# EAGLE design untitled (EAGLE 9.1.0)
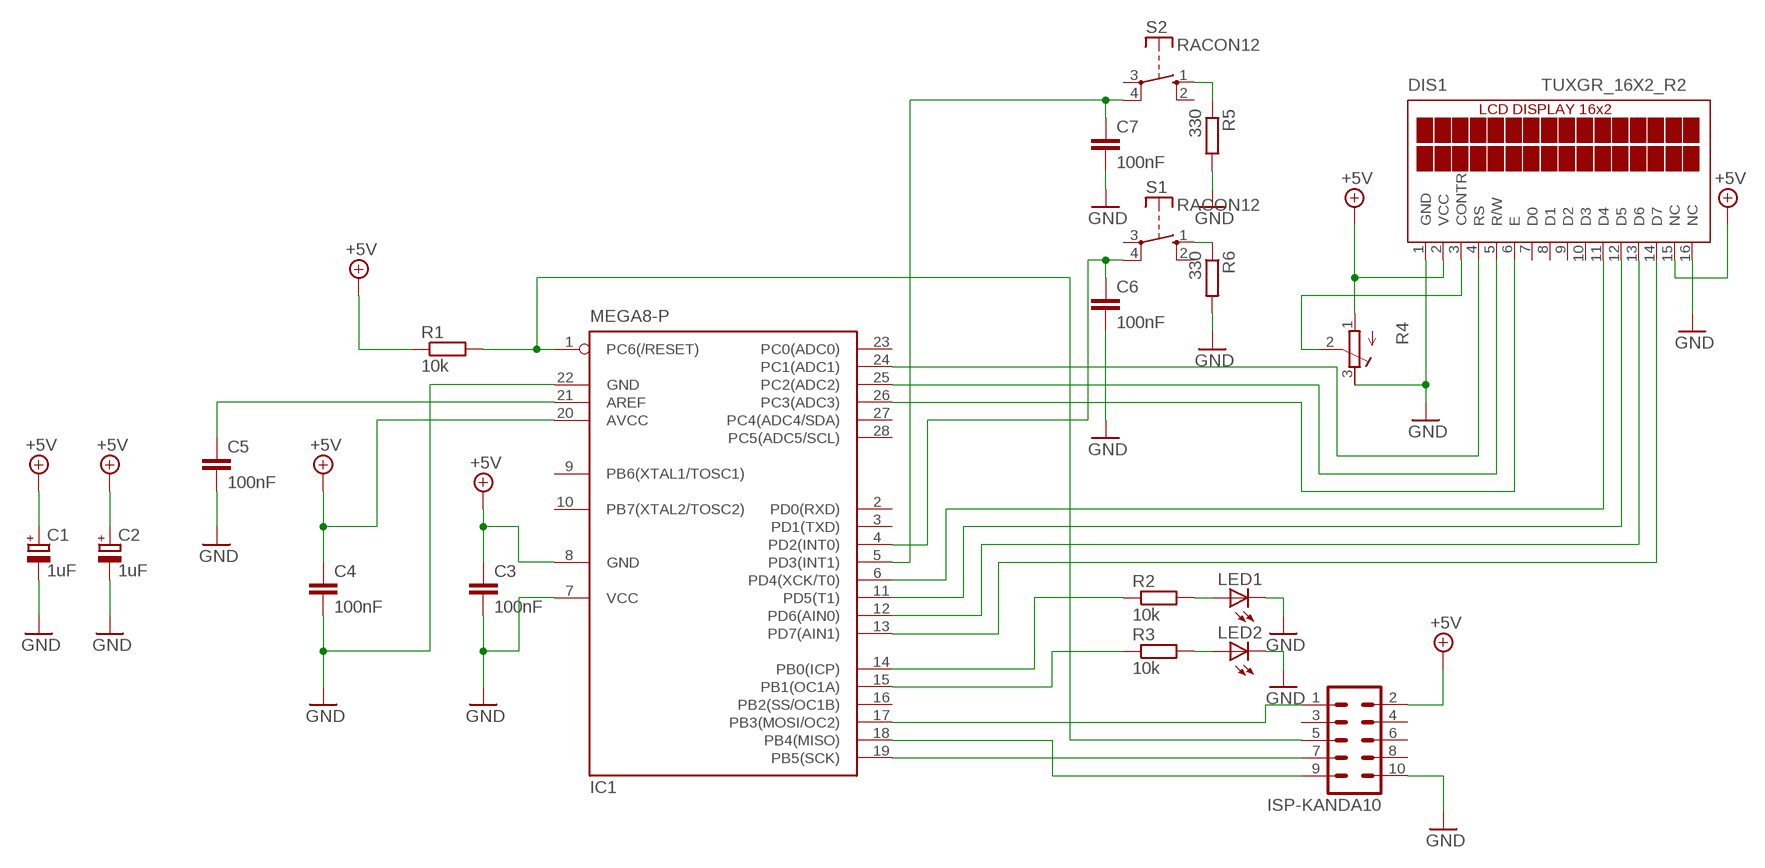
[diagram p0: schematic, sheet 1]

## Parts
C1  1uF  CPOL-EUE2-5  [E2-5]
C2  1uF  CPOL-EUE3.5-8  [E3,5-8]
C3  100nF  C-EU050-024X044  [C050-024X044]
C4  100nF  C-EU050-024X044  [C050-024X044]
C5  100nF  C-EU050-024X044  [C050-024X044]
C6  100nF  C-EU050-024X044  [C050-024X044]
C7  100nF  C-EU050-024X044  [C050-024X044]
DIS1  TUXGR_16X2_R2  [TUXGR_16X2_R2]
IC1  MEGA8-P  [DIL28-3]
ISP-KANDA10  ML10  [ML10]
LED1  LED3MM  [LED3MM]
LED2  LED3MM  [LED3MM]
R1  10k  R-EU_0204/7  [0204/7]
R2  10k  R-EU_0204/7  [0204/7]
R3  10k  R-EU_0204/7  [0204/7]
R4  R-TRIMM3339P  [RTRIM3339P]
R5  330  R-EU_0204/7  [0204/7]
R6  330  R-EU_0204/7  [0204/7]
S1  RACON12  [RACON12]
S2  RACON12  [RACON12]

## Nets
+5V: C1.+ C2.+ C3.1 C4.1 DIS1.2(VCC) DIS1.15(NC) IC1.8(GND) IC1.20(AVCC) ISP-KANDA10.2 R1.1 R4.1(A)
GND: C1.- C2.- C3.2 C4.2 C5.2 C6.2 C7.2 DIS1.1(GND) DIS1.16(NC) IC1.7(VCC) IC1.22(GND) ISP-KANDA10.10 LED1.K(C) LED2.K(C) R4.3(E) R5.2 R6.2
N$1: IC1.1(PC6(/RESET)) ISP-KANDA10.5 R1.2
N$2: IC1.17(PB3(MOSI/OC2)) ISP-KANDA10.1
N$3: IC1.15(PB1(OC1A)) R3.1
N$4: IC1.19(PB5(SCK)) ISP-KANDA10.7
N$5: IC1.18(PB4(MISO)) ISP-KANDA10.9
N$6: C6.1 IC1.4(PD2(INT0)) S1.4(P)
N$7: IC1.14(PB0(ICP)) R2.1
N$8: LED1.A R2.2
N$9: C5.1 IC1.21(AREF)
N$10: LED2.A R3.2
N$11: DIS1.3(CONTR) R4.2(S)
N$12: DIS1.4(RS) IC1.24(PC1(ADC1))
N$13: DIS1.14(D7) IC1.13(PD7(AIN1))
N$14: DIS1.13(D6) IC1.12(PD6(AIN0))
N$15: DIS1.12(D5) IC1.11(PD5(T1))
N$16: DIS1.11(D4) IC1.6(PD4(XCK/T0))
N$17: DIS1.5(R/W) IC1.25(PC2(ADC2))
N$18: DIS1.6(E) IC1.26(PC3(ADC3))
N$19: C7.1 IC1.5(PD3(INT1)) S2.4(P)
N$20: R5.1 S2.1(S)
N$21: R6.1 S1.1(S)
Unconnected: DIS1.7(D0) DIS1.8(D1) DIS1.9(D2) DIS1.10(D3) IC1.2(PD0(RXD)) IC1.3(PD1(TXD)) IC1.9(PB6(XTAL1/TOSC1)) IC1.10(PB7(XTAL2/TOSC2)) IC1.16(PB2(SS/OC1B)) IC1.23(PC0(ADC0)) IC1.27(PC4(ADC4/SDA)) IC1.28(PC5(ADC5/SCL)) ISP-KANDA10.3 ISP-KANDA10.4 ISP-KANDA10.6 ISP-KANDA10.8 S1.2(S) S1.3(P) S2.2(S) S2.3(P)

## Library data of the parts
C1 C2 = rcl:CPOL-EU: POLARIZED CAPACITOR, European symbol; SPICEPREFIX: C
C3-C7 = rcl:C-EU: CAPACITOR, European symbol; SPICEPREFIX: C
DIS1 = display-lcd:TUXGR_16X2_R2: Tuxgraphics LCD display 16x2 characters reflective, without background light Source: tuxgr_12x2_r2.pdf; OC_FARNELL: unknown; OC_NEWARK: unknown
IC1 = atmel:MEGA8-P: MICROCONTROLLER 8 Kbytes FLASH, 1 kbytes SRAM, 512 bytes EEPROM, USART, 4-channel 10 bit ADC, 2-channel 8 bit ADC Pin compatible with Atmega48, ATMega88, ATMega168 Source: avr.lbr; OC_FARNELL: unknown; OC_NEWARK: unknown
ISP-KANDA10 = con-harting-ml:ML10: HARTING; OC_FARNELL: unknown; OC_NEWARK: unknown
LED1 LED2 = led:LED: LED OSRAM: - CHIPLED LG R971, LG N971, LY N971, LG Q971, LY Q971, LO R971, LY R971 LH N974, LH R974 LS Q976, LO Q976, LY Q976 LO Q996 - Hyper CHIPLED LW Q18S LB Q993, LB Q99A, LB R99A - SideLED LS A670, LO A670, LY A670, LG A670, LP A670 LB A673, LV A673, LT A673, LW A673 LH A674 LY A675 LS A676, LA A676, LO A676, LY A676, LW A676 LS A679, LY A679, LG A679 - Hyper Micro SIDELED® LS Y876, LA Y876, LO Y876, LY Y876 LT Y87S - SmartLED LW L88C, LW L88S LB L89C, LB L89S, LG L890 LS L89K, LO L89K, LY L89K LS L896, LA L896, LO L896, LY L896 - TOPLED LS T670, LO T670, LY T670, LG T670, LP T670 LSG T670, LSP T670, LSY T670, LOP T670, LYG T670 LG T671, LOG T671, LSG T671 LB T673, LV T673, LT T673, LW T673 LH T674 LS T676, LA T676, LO T676, LY T676, LB T676, LH T676, LSB T676, LW T676 LB T67C, LV T67C, LT T67C, LS T67K, LO T67K, LY T67K, LW E67C LS E67B, LA E67B, LO E67B, LY E67B, LB E67C, LV E67C, LT E67C LW T67C LS T679, LY T679, LG T679 LS T770, LO T770, LY T770, LG T770, LP T770 LB T773, LV T773, LT T773, LW T773 LH T774 LS E675, LA E675, LY E675, LS T675 LS T776, LA T776, LO T776, LY T776, LB T776 LHGB T686 LT T68C, LB T68C - Hyper Mini TOPLED® LB M676 - Mini TOPLED Santana® LG M470 LS M47K, LO M47K, LY M47K Source: http://www.osram.convergy.de LUXEON: - LUMILED® LXK2-PW12-R00, LXK2-PW12-S00, LXK2-PW14-U00, LXK2-PW14-V00 LXK2-PM12-R00, LXK2-PM12-S00, LXK2-PM14-U00 LXK2-PE12-Q00, LXK2-PE12-R00, LXK2-PE12-S00, LXK2-PE14-T00, LXK2-PE14-U00 LXK2-PB12-K00, LXK2-PB12-L00, LXK2-PB12-M00, LXK2-PB14-N00, LXK2-PB14-P00, LXK2-PB14-Q00 LXK2-PR12-L00, LXK2-PR12-M00, LXK2-PR14-Q00, LXK2-PR14-R00 LXK2-PD12-Q00, LXK2-PD12-R00, LXK2-PD12-S00 LXK2-PH12-R00, LXK2-PH12-S00 LXK2-PL12-P00, LXK2-PL12-Q00, LXK2-PL12-R00 Source: www.luxeon.com KINGBRIGHT: KA-3528ASYC Source: www.kingbright.com
R1-R3 R5 R6 = rcl:R-EU_: RESISTOR, European symbol; SPICEPREFIX: R
R4 = rcl:R-TRIMM: Trimm resistor; SPICEMODEL: X; SPICEPREFIXL: POT
S1 S2 = switch-misc:RACON12: ITT SWITCH

## Board
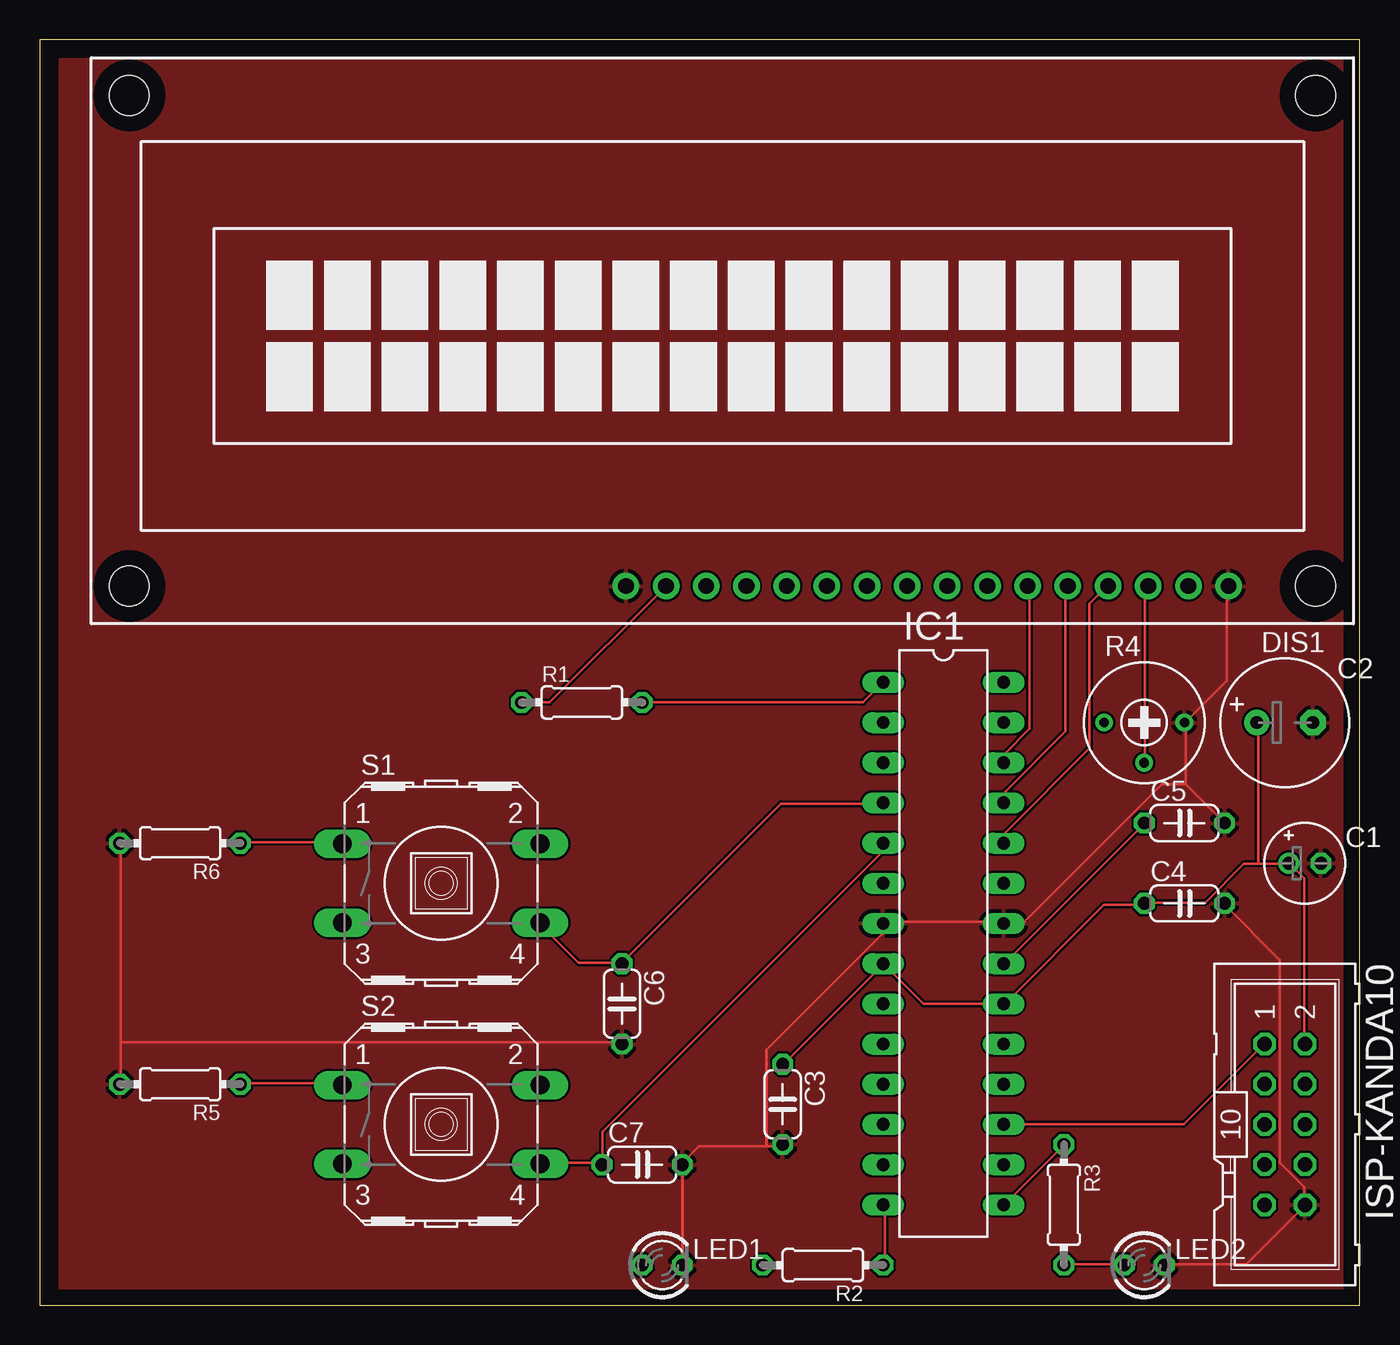
[diagram p1: board, top side]
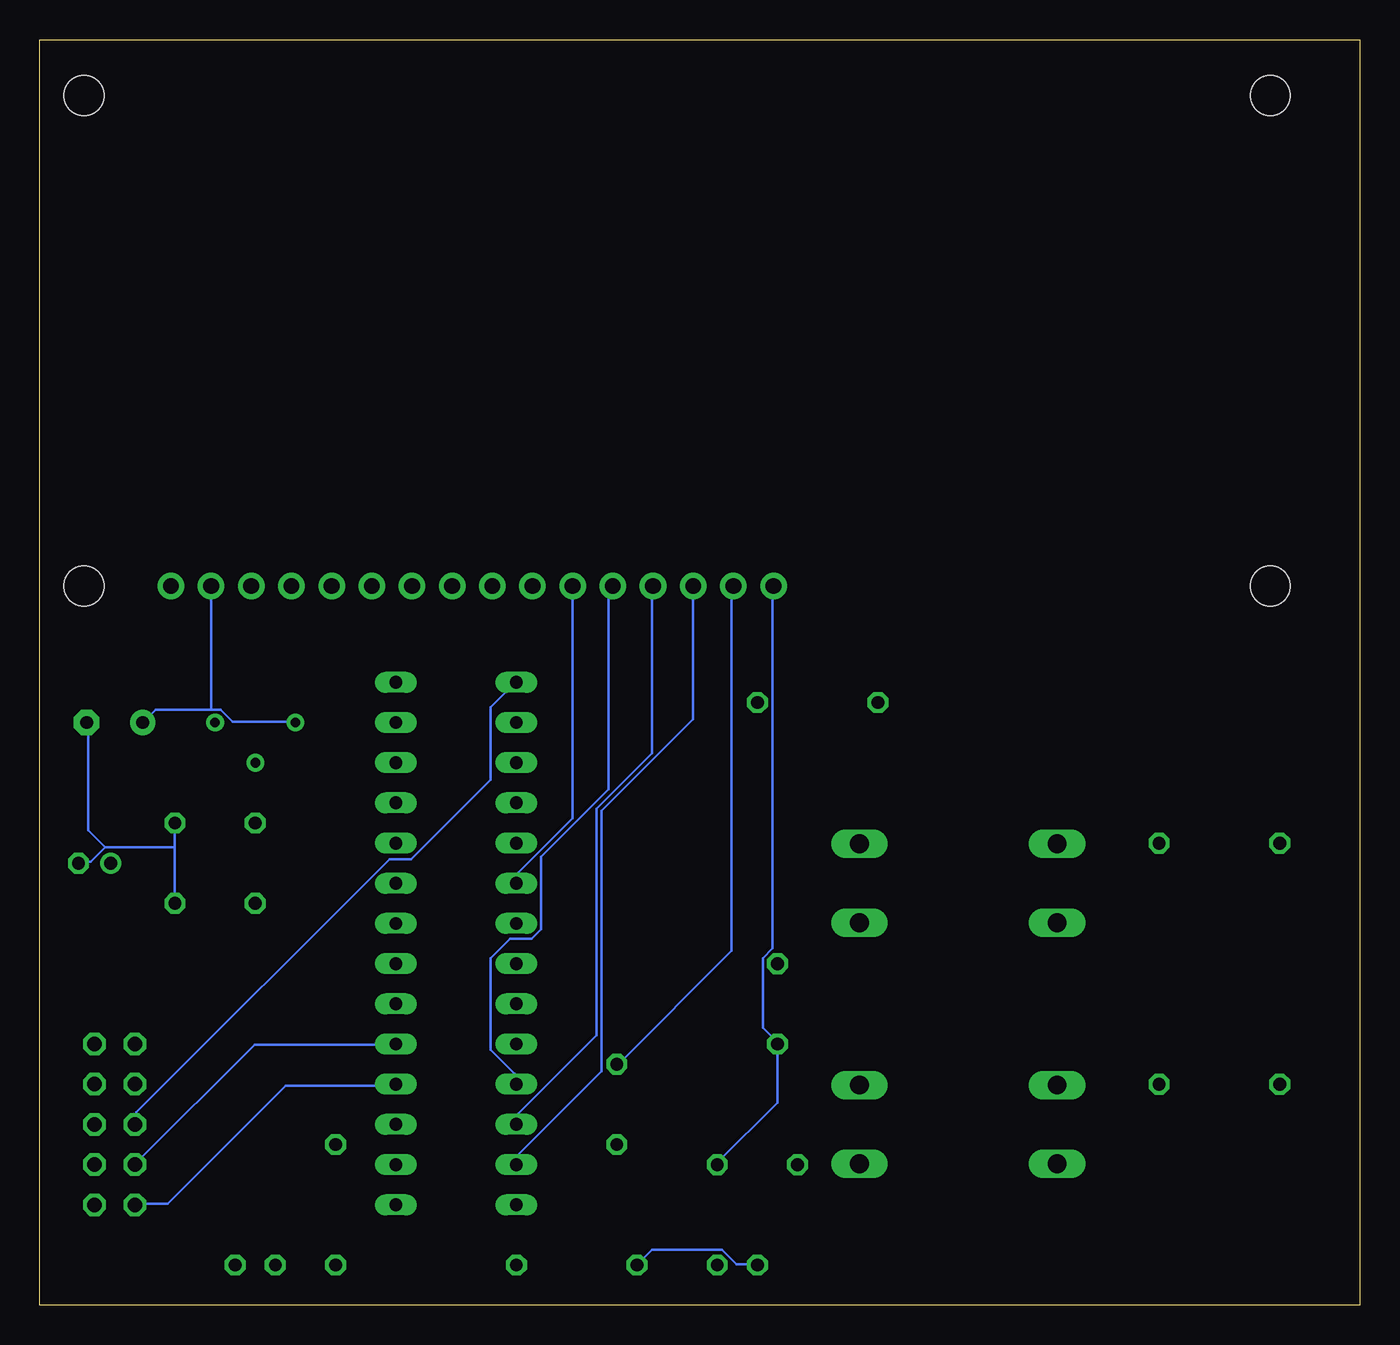
[diagram p2: board, bottom side, seen from below]

Size 83.49 x 80 mm. Coordinates in mm from the lower left corner, seen from the top.
Outline: 0,0 83.49,0 83.49,80 0,80 0,0
Copper layers (1*16): Top 0.035mm / dielectric 1.5mm / Bottom 0.035mm
Design rules "default": minimum track width 6mil, minimum drill 0.35mm, track to track 6mil, track to pad 6mil, pad to pad 6mil, via to via 6mil, smd to smd 6mil, copper to edge 40mil, drill to drill 6mil, minimum pad ring 10mil, minimum via ring 8mil, stop-mask expansion 4mil, vias tented up to drill 0mil, thermal gap 10mil

### Footprints (pad centres in the part's own frame; a part is rotated, then mirrored left to right if it is on the bottom)
E2-5 = drill 0.813 pad 1.27: + -1.016,0 | drill 0.813 pad 1.27 octagon: - 1.016,0
E3,5-8 = drill 0.813 pad 1.6: + -1.778,0 | drill 0.813 pad 1.6 octagon: - 1.778,0
C050-024X044 = drill 0.813 octagon: 1 -2.54,0; 2 2.54,0
TUXGR_16X2_R2 = drill 1 pad 1.676: 1 -32,15.5; 2 -29.46,15.5; 3 -26.92,15.5; 4 -24.38,15.5; 5 -21.84,15.5; 6 -19.3,15.5; 7 -16.76,15.5; 8 -14.22,15.5; 9 -11.68,15.5; 10 -9.14,15.5; 11 -6.6,15.5; 12 -4.06,15.5; 13 -1.52,15.5; 14 1.02,15.5; 15 3.56,15.5; 16 6.1,15.5 | hole 2.5: -37.5,-15.5; 37.5,-15.5; -37.5,15.5; 37.5,15.5
DIL28-3 = drill 0.813 long: 1 -16.51,-3.81; 2 -13.97,-3.81; 3 -11.43,-3.81; 4 -8.89,-3.81; 5 -6.35,-3.81; 6 -3.81,-3.81; 7 -1.27,-3.81; 8 1.27,-3.81; 9 3.81,-3.81; 10 6.35,-3.81; 11 8.89,-3.81; 12 11.43,-3.81; 13 13.97,-3.81; 14 16.51,-3.81; 15 16.51,3.81; 16 13.97,3.81; 17 11.43,3.81; 18 8.89,3.81; 19 6.35,3.81; 20 3.81,3.81; 21 1.27,3.81; 22 -1.27,3.81; 23 -3.81,3.81; 24 -6.35,3.81; 25 -8.89,3.81; 26 -11.43,3.81; 27 -13.97,3.81; 28 -16.51,3.81
ML10 = drill 0.914 octagon: 1 -5.08,-1.27; 2 -5.08,1.27; 3 -2.54,-1.27; 4 -2.54,1.27; 5 0,-1.27; 6 0,1.27; 7 2.54,-1.27; 8 2.54,1.27; 9 5.08,-1.27; 10 5.08,1.27
LED3MM = drill 0.813 octagon: A -1.27,0; K 1.27,0
0204/7 = drill 0.813 octagon: 1 -3.81,0; 2 3.81,0
RTRIM3339P = drill 0.61: 1 -2.54,0; 2 0,-2.54; 3 2.54,0
RACON12 = drill 1.194 long: 1 -6.248,2.489; 2 6.248,2.489; 3 -6.248,-2.489; 4 6.248,-2.489

### Placement (x,y rotation side)
C1  80.01,27.94 0 top
C2  78.74,36.83 0 top
C3  46.99,12.7 270 top
C4  72.39,25.4 0 top
C5  72.39,30.48 0 top
C6  36.83,19.05 270 top
C7  38.1,8.89 0 top
DIS1  43.18,60.96 180 top
IC1  57.15,22.86 270 top
ISP-KANDA10  78.74,11.43 270 top
LED1  39.37,2.54 0 top
LED2  69.85,2.54 0 top
R1  34.29,38.1 0 top
R2  49.53,2.54 180 top
R3  64.77,6.35 270 top
R4  69.85,36.83 0 top
R5  8.89,13.97 180 top
R6  8.89,29.21 180 top
S1  25.4,26.67 0 top
S2  25.4,11.43 0 top

### Tracks (layer width: path | path; a pad name or v marks a point on that pad's centre or on a via)
+5V
  Top 0.152: 77.06,27.89 78.89,27.89 C1.+ 79.05,27.89 79.96,26.98 79.96,16.61 ISP-KANDA10.2 | 77.06,27.89 76.15,27.89 73.71,25.45 69.9,25.45 C4.1 69.75,25.3 67.31,25.3 61.06,19.05 IC1.20 60.91,19.05 55.88,19.05 53.44,21.49 IC1.8 53.29,21.49 47.04,15.24 C3.1 | 77.06,27.89 77.06,36.73 C2.+ | R1.1 30.58,38.1 32.26,38.1 39.57,45.41 DIS1.15
  Bottom 0.152: 72.64,37.64 76.15,37.64 76.91,36.88 C2.+ | 72.64,37.64 72.03,37.64 71.27,36.88 67.31,36.88 R4.1 | 72.64,37.64 72.64,45.41 DIS1.2 | DIS1.15 39.73,45.41 39.73,22.4 46.89,15.24 C3.1
GND
  Top 0.152: LED2.K 71.12,2.59 76.3,2.59 79.96,6.25 ISP-KANDA10.10 79.96,6.4 79.96,7.47 78.43,8.99 78.43,21.79 74.93,25.3 C4.2 | 72.49,32.92 72.49,36.73 R4.3 72.49,36.88 75.08,39.47 75.08,45.41 DIS1.1 | C5.2 72.49,32.92 | 72.49,32.92 70.97,32.92 62.28,24.23 61.06,24.23 IC1.22 60.91,24.23 53.44,24.23 IC1.7 53.29,24.08 53.29,23.47 45.97,16.15 45.97,10.06 | 5.13,16.61 5.13,29.11 R6.2 | 5.13,16.61 5.13,14.02 R5.2 | LED1.K 40.64,2.59 40.64,8.84 C7.2 40.64,8.99 41.71,10.06 45.97,10.06 | 45.97,10.06 46.89,10.06 C3.2 | 5.13,16.61 36.83,16.61 C6.2
  Bottom 0.152: C5.2 74.93,28.96 | 74.93,28.96 74.93,25.45 C4.2 | 79.35,28.96 80.26,28.04 81.03,28.04 C1.- | 74.93,28.96 79.35,28.96 | 79.35,28.96 80.42,30.02 80.42,36.73 C2.- | C7.2 40.64,8.99 36.83,12.8 36.83,16.46 C6.2 36.83,16.61 37.74,17.53 37.74,21.95 37.14,22.55 37.14,45.41 DIS1.16
  pour Top: 1.27,78.74 82.55,78.74 82.55,0 1.27,0
N$1
  Top 0.152: R1.2 38.2,38.1 52.07,38.1 53.29,39.32 IC1.1
  Bottom 0.152: ISP-KANDA10.5 77.37,11.43 77.37,12.19 61.37,28.19 59.99,28.19 54.97,33.22 54.97,37.8 53.44,39.32 IC1.1
N$2
  Top 0.152: IC1.17 61.06,11.43 72.34,11.43 77.37,16.46 ISP-KANDA10.1
N$3
  Top 0.152: IC1.15 61.06,6.4 64.72,10.06 R3.1
N$4
  Bottom 0.152: IC1.19 61.06,16.46 69.9,16.46 77.37,8.99 ISP-KANDA10.7
N$5
  Bottom 0.152: IC1.18 61.06,13.87 67.92,13.87 75.39,6.4 77.37,6.4 ISP-KANDA10.9
N$6
  Top 0.152: 36.83,21.64 34.09,21.64 31.65,24.08 S1.4 | 36.83,21.64 C6.1 36.83,21.64 | 36.83,21.64 46.89,31.7 53.29,31.7 IC1.4
N$7
  Top 0.152: R2.1 53.44,2.59 53.44,6.25 IC1.14
N$8
  Bottom 0.152: LED1.A 38.2,2.59 39.42,2.59 40.33,3.5 44.75,3.5 45.67,2.59 R2.2
N$9
  Top 0.152: IC1.21 61.06,21.64 69.9,30.48 C5.1
N$10
  Top 0.152: R3.2 64.87,2.59 68.53,2.59 LED2.A
N$11
  Top 0.152: R4.2 69.9,34.29 69.9,45.26 70.05,45.41 DIS1.3
N$12
  Top 0.152: IC1.24 61.06,29.26 61.06,29.87 66.4,35.2 66.4,44.35 67.46,45.41 DIS1.4
N$13
  Bottom 0.152: IC1.13 53.29,8.99 53.29,9.45 47.95,14.78 47.95,31.24 42.16,37.03 42.16,45.41 DIS1.14
N$14
  Bottom 0.152: IC1.12 53.29,11.43 53.29,12.04 48.26,17.07 48.26,31.39 44.75,34.9 44.75,45.41 DIS1.13
N$15
  Bottom 0.152: IC1.11 53.44,14.02 53.44,14.63 54.97,16.15 54.97,21.95 53.75,23.16 52.38,23.16 51.77,23.77 51.77,28.35 47.5,32.61 47.5,45.26 47.35,45.41 DIS1.12
N$16
  Bottom 0.152: IC1.6 53.29,26.67 53.29,27.28 49.78,30.79 49.78,45.41 DIS1.11
N$17
  Top 0.152: IC1.25 61.06,31.85 61.06,32.46 64.87,36.27 64.87,45.41 DIS1.5
N$18
  Top 0.152: IC1.26 61.06,34.29 61.06,34.9 62.59,36.42 62.59,45.41 DIS1.6
N$19
  Top 0.152: S2.4 31.65,8.99 35.46,8.99 C7.1 35.61,8.99 35.61,10.97 53.29,28.65 53.29,29.11 IC1.5
N$20
  Top 0.152: R5.1 12.75,14.02 19.15,14.02 S2.1
N$21
  Top 0.152: R6.1 12.75,29.26 19.15,29.26 S1.1